# Altium schematic sheet Sheet1.SchDoc
size A
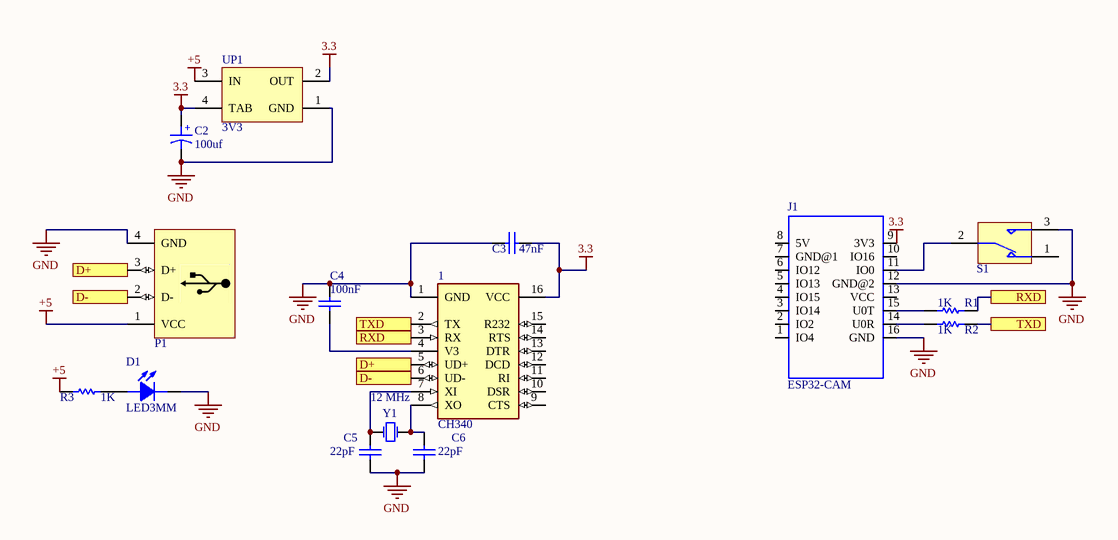
[diagram p0: Sheet1.SchDoc]

## Parts
1  CH340  [SOIC16]
C2  100uf  [Cap electrolitic radial 6.3x12-2.5]
C3  47nF  [Cap-100nF]
C4  100nF  [Cap-100nF]
C5  22pF  [Cap-100nF]
C6  22pF  [Cap-100nF]
D1  LED3MM  [LED3mm_GRN]
J1  ESP32-CAM  [ESP32-CAM]
P1  USB Connector  [USB A TYPE Right Angle]  (value not drawn)
R1  1K  [RES-(1/4)]
R2  1K  [RES-(1/4)]
R3  1K  [RES-(1/4)]
S1  Switch SPDT_Subminiator  [SPDT Subminiator]  (value not drawn)
UP1  3V3  [SOT223]
Y1  12 MHz  [XTAL 16MHZ]

## Ports
D+, D-, RXD, TXD

## Nets
3.3: 1.16(VCC) C2.1 C3.1 J1.9(3V3) UP1.2(OUT) UP1.4(TAB)
+5: P1.1(VCC) R3.1 UP1.3(IN)
GND: 1.1(GND) C2.2 C3.2 C4.2 C5.1 C6.1 D1.2(CATHODE) J1.12(GND@2) J1.16(GND) P1.4(GND) S1.3 UP1.1(GND)
D+: 1.5(UD+) P1.3(D+) ; port D+
D-: 1.6(UD-) P1.2(D-) ; port D-
RXD: 1.3(RX) R1.1 ; port RXD
TXD: 1.2(TX) R2.1 ; port TXD
Net1_4: 1.4(V3) C4.1
Net1_7: 1.7(XI) C5.2 Y1.1(OSC1)
Net1_8: 1.8(XO) C6.2 Y1.2(OSC2)
NetD1_1: D1.1(ANODE) R3.2
NetJ1_11: J1.11(IO0) S1.2
NetJ1_14: J1.14(U0R) R2.2
NetJ1_15: J1.15(U0T) R1.2

Not connected (* = marked no-connect by the designer): 1 9(CTS) 10(DSR) 11(RI) 12(DCD) 13(DTR) 14(RTS) 15(R232); J1 1(IO4) 2(IO2) 3(IO14) 4(IO15) 5(IO13) 6(IO12) 7(GND@1) 8(5V) 10(IO16) 13(VCC); S1 1

## Notes on the sheet
- (in symbol Cap ELECTROLITIC TOTAL SIZE) +

## Library data of the parts
1 = CH340: Circuit Breaker Magnetic 3Pole 40A 240VAC; MF: Eaton; Availability: Unavailable; Price: None; Package: None; Value: *; SnapEDA_Link: https://www.snapeda.com/parts/CH340/Eaton/view-part/4701946/?ref=snap; MP: CH340
C2 = Cap ELECTROLITIC TOTAL SIZE: Cap electrolitic radial; Designer: Abbas Basereh; VALUE: 1uF; Data: 16-12-2016; Part. No: *
C3-C6 = CAP CERAMIC TOTAL SIZE: CAP Ceramic Total; Designer: Ali Hafizi
D1 = LED 3MM: Light Emitting Diode; Designer: Ali Hafizi
J1 = ESP32-CAM: The smallest 802.11b/g/n Wi-Fi BT SoC Module; MF: AI-Thinker; Check_prices: https://www.snapeda.com/parts/ESP32-CAM/AI-Thinker/view-part/5507632/?ref=eda; Package: Package; SnapEDA_Link: https://www.snapeda.com/parts/ESP32-CAM/AI-Thinker/view-part/5507632/?ref=snap; Value: *; Price: None; MP: ESP32-CAM; Availability: Unavailable
P1 = USB A-Type: USB Connector-A Type
R1-R3 = RES DIP PACKAGE: TOTAL DIP RESISTOR PACK; Designer: Ali Hafizi
S1 = Switch SPDT_Subminiator: Subminiator SPDT Switch; Company: E.P.I.L; Design date: 2011/11/02
UP1 = AMS1117-x.x: x.x Volt, 800mA Low-Dropout Linear Regulator, 4-pin SOT-223; Designer: Ali Hafizi; Data: 16-12-2016
Y1 = XTAL: XTAL Crystal; Designer: ABBAS BASEREH; Design Date: 2017-1-3; ComponentLink1Description: Datasheet; ComponentLink2Description: Reference; Mounting Technology: Surface Mount\Through-Hole; Value: 12 MHz; Status: Unreleased